# Altium project UWRT_Project_Template.PrjPcb
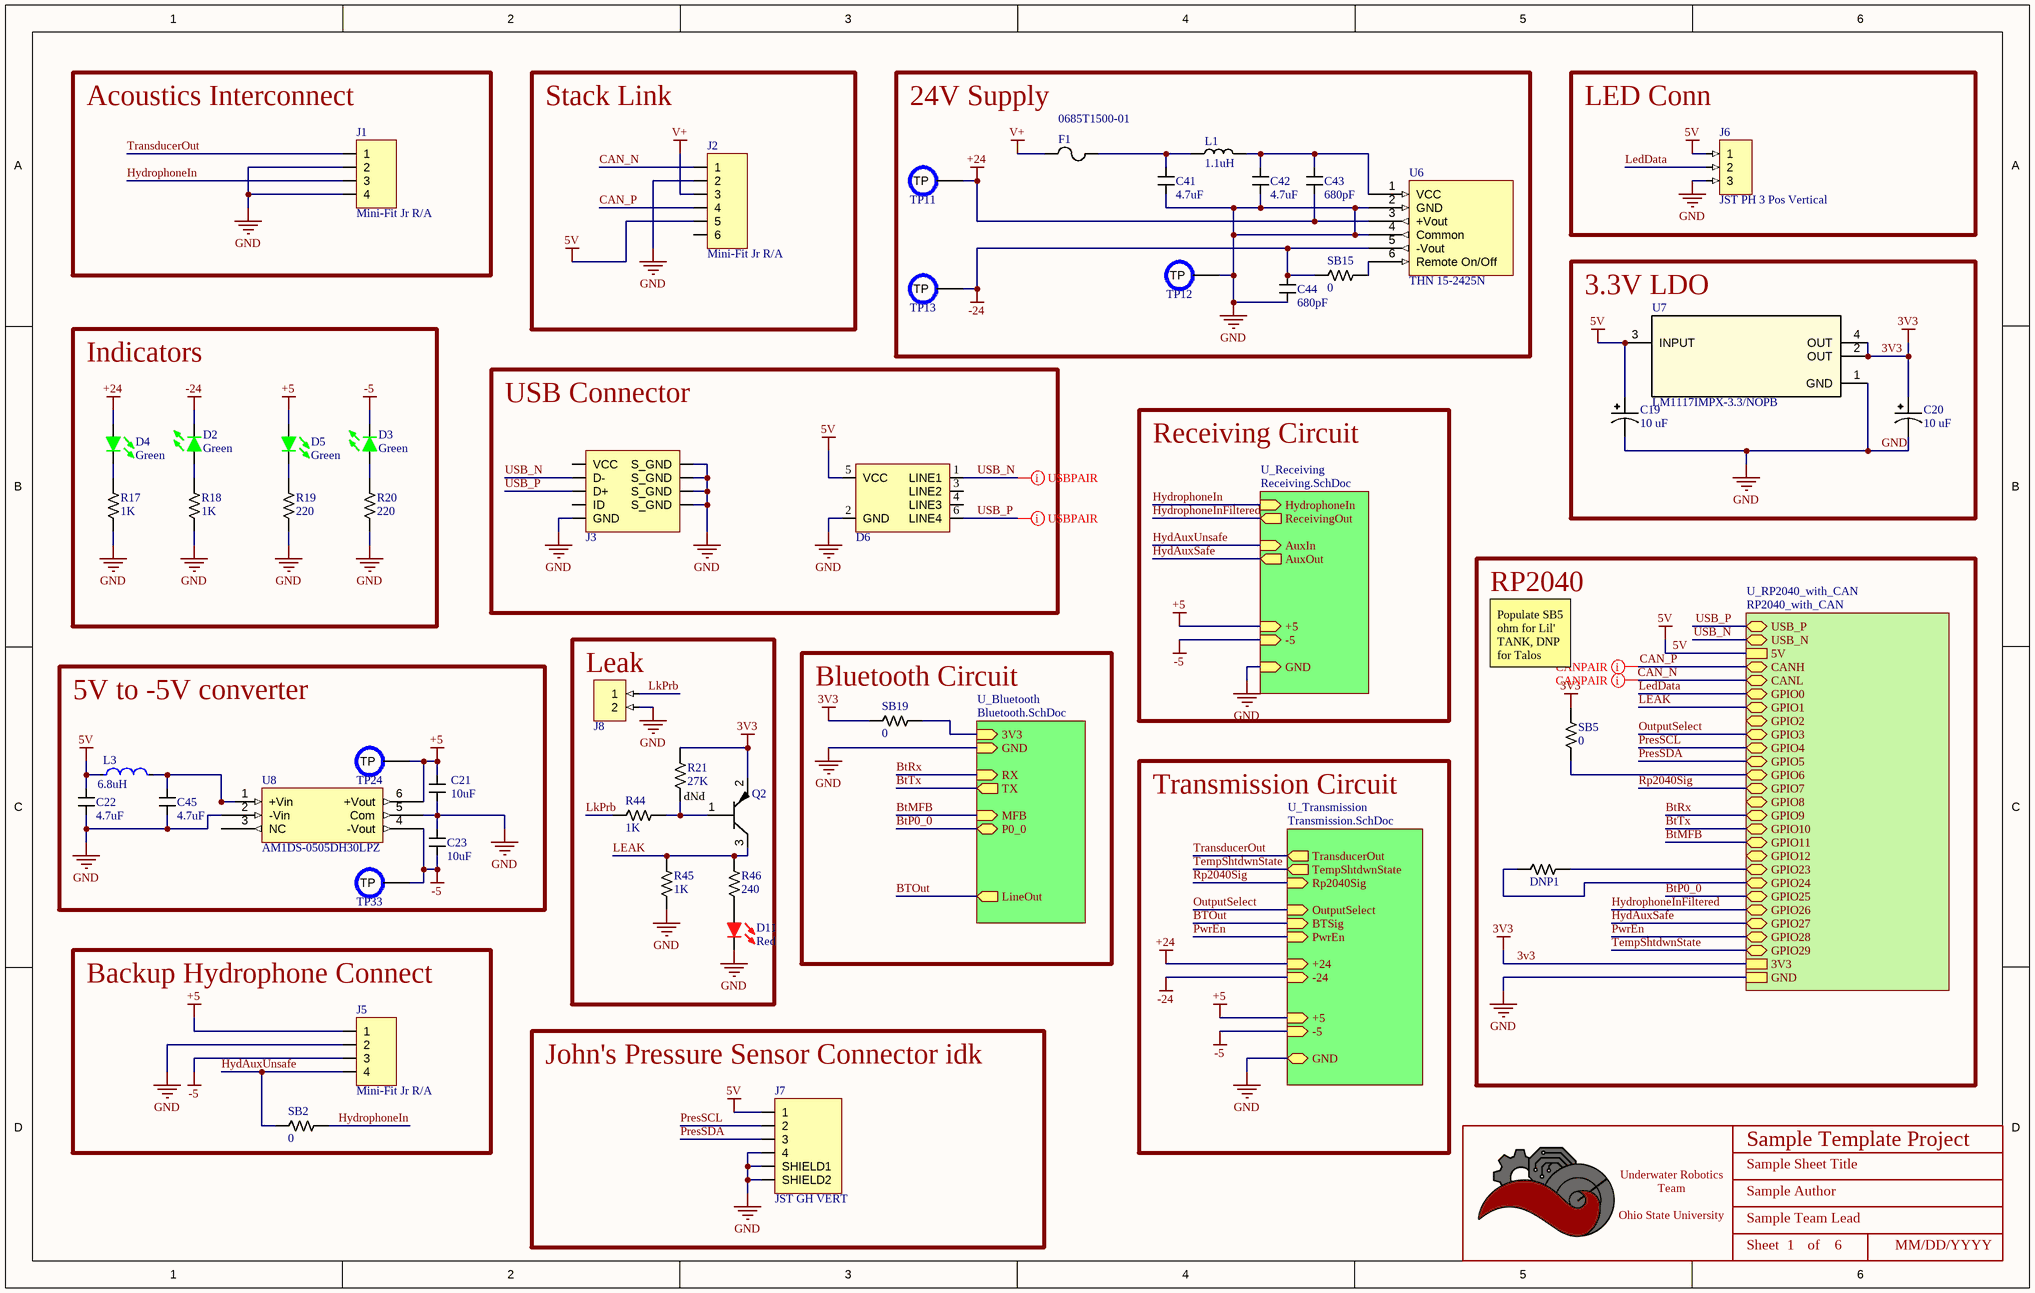
[diagram p0: PowerAndConnections.SchDoc]
BoardRevision: 1.0; DateOfDesignReview: XX/XX/XXXX; ProjectTitle: Sample Template Project; TeamLead: Sample Team Lead
3 sheets, 161 parts. Net scope: hierarchical (ports join the sheet entries above them; power ports are global).
Board files: Pcb_4layer_4x4_Template.PcbDoc, Pcb_2layer_4x4_Template.PcbDoc, Pcb_2layer_8x4_Template_NoCenterHoles.PcbDoc, Pcb_4layer_8x4_Template_NoCenterHoles.PcbDoc, Pcb_2layer_8x4_Template.PcbDoc, Pcb_4layer_8x4_Template.PcbDoc
Sheets:
  PowerAndConnections.SchDoc
    U_Receiving = Receiving.SchDoc
    U_Transmission = Transmission.SchDoc

## Sheet PowerAndConnections.SchDoc: Sample Sheet Title
size B; Date: MM/DD/YYYY; Author: Sample Author; Organization: ORGANIZATION; Address1: ADDRESS 1; Address2: ADDRESS 2; Address3: ADDRESS 3; Address4: ADDRESS 4; Revision: -; SheetNumber: 1; SheetTotal: 6; ENG_APP_DATE: --/--/--; DSN_APP_DATE: --/--/--; CHK_APP_DATE: --/--/--

### Parts
(Parts that share a designator on the sheet are numbered #1, #2 ... from top to bottom, then left to right.)
*#1  Title_Block  [LOGO]  (value not drawn)  (graphical)
C19  Value (uF): 10 uF  [CAPACITOR_1206 - POLAR]  (hidden comment: 10uF Tantalum 16V)
C20  Value (uF): 10 uF  [CAPACITOR_1206 - POLAR]  (hidden comment: 10uF Tantalum 16V)
C21  value 10uF  [CAPACITOR_0603]  (hidden comment: CL10X106MO8NRNC)
C22  value 4.7uF  [CAPACITOR_0603]  (hidden comment: 4.7uF Ceramic 6.3V)
C23  value 10uF  [CAPACITOR_0603]  (hidden comment: CL10X106MO8NRNC)
C41  value 4.7uF  [CAPACITOR_1206]  (hidden comment: AGC1206X7R500-475KXE*)
C42  value 4.7uF  [CAPACITOR_1206]  (hidden comment: AGC1206X7R500-475KXE*)
C43  value 680pF  [CAPACITOR_1808]  (hidden comment: CC1808KKX7REBB681)
C44  value 680pF  [CAPACITOR_1808]  (hidden comment: CC1808KKX7REBB681)
C45  value 4.7uF  [CAPACITOR_0603]  (hidden comment: 4.7uF Ceramic 6.3V)
D2  Color: Green  [LED_0603]  (hidden comment: 150060GS75000)
D3  Color: Green  [LED_0603]  (hidden comment: 150060GS75000)
D4  Color: Green  [LED_0603]  (hidden comment: 150060GS75000)
D5  Color: Green  [LED_0603]  (hidden comment: 150060GS75000)
D6  TVS DIODE 5VWM 25VC SOT23-6  [SOT 23-6L]  (value not drawn)
D11  Color: Red  [LED_0603]  (hidden comment: 150060RS75000)
DNP1  DNP  [RESISTOR_0402]  (value not drawn)
F1  0685T1500-01  [CAPACITOR_1206]
J1  Mini-Fit Jr R/A  [CONN_MOLEX_MINIFIT JR_4 POS_R/A]
J2  Mini-Fit Jr R/A  [CONN_MOLEX_MINIFIT JR_6 POS_R/A]
J3  USB_MICRO R/A  [CONN_MINIUSB]  (value not drawn)
J5  Mini-Fit Jr R/A  [CONN_MOLEX_MINIFIT JR_4 POS_R/A]
J6  JST PH 3 Pos Vertical  [CONN_JST_PH_3POS_VERT]
J7  JST GH VERT  [CONN_JST_BM04B-GHS-TBT(LF)(SN)(N)]
J8  CONN_JST_PH_2POS_VERT  [CONN_JST_PH_2POS_VERT]  (value not drawn)
L1  value 1.1uH  [INDUCTOR_TCK078]  (hidden comment: TCK-078)
L3  value 6.8uH  [INDUCTOR_0805]  (hidden comment: MLZ2012N6R8LT000)
Q2  PNP 60V 600mA SOT23  [SOT-23-3]  (value not drawn)
R17  Value  (Ohms): 1K  [RESISTOR_0603]  (hidden comment: 1k Ohm 5% 1/8W)
R18  Value  (Ohms): 1K  [RESISTOR_0603]  (hidden comment: 1k Ohm 5% 1/8W)
R19  Value  (Ohms): 220  [RESISTOR_0603]  (hidden comment: 220 Ohm 5% 1/8W)
R20  Value  (Ohms): 220  [RESISTOR_0603]  (hidden comment: 220 Ohm 5% 1/8W)
R21  Value  (Ohms): 27K  [RESISTOR_0603]  (hidden comment: 27k Ohm 5% 1/8W)
R44  Value  (Ohms): 1K  [RESISTOR_0603]  (hidden comment: 1k Ohm 5% 1/8W)
R45  Value  (Ohms): 1K  [RESISTOR_0603]  (hidden comment: 1k Ohm 5% 1/8W)
R46  Value  (Ohms): 240  [RESISTOR_0603]  (hidden comment: RES SMD 240 OHM 5% 1/10W 0603)
SB2#1  Value  (Ohms): 0  [RESISTOR_0603]  (hidden comment: 0 Ohm Jumper No Fit)
SB5  Value  (Ohms): 0  [RESISTOR_0603]  (hidden comment: 0 Ohm Jumper No Fit)
SB15  value 0  [RESISTOR_1206]  (hidden comment: JUMPER_0_1206)
SB19  Value  (Ohms): 0  [RESISTOR_0603]  (hidden comment: 0 Ohm Jumper No Fit)
TP11  PCB Test Point  [TESTPOINT_1.2MM]  (value not drawn)  (no BOM)
TP12  PCB Test Point  [TESTPOINT_1.2MM]  (value not drawn)  (no BOM)
TP13  PCB Test Point  [TESTPOINT_1.2MM]  (value not drawn)  (no BOM)
TP24#1  PCB Test Point  [TESTPOINT_1.2MM]  (value not drawn)  (no BOM)
TP33  PCB Test Point  [TESTPOINT_1.2MM]  (value not drawn)  (no BOM)
U6  THN 15-2425N  [THN_15-2425N]
U7  LM1117IMPX-3.3/NOPB  [SOT-223-4]
U8  AM1DS-0505DH30LPZ  [AM1DS-0505DH30LPZ]

### Blocks framed on the sheet
Acoustics Interconnect: J1
Stack Link: J2
24V Supply: C41-C44 F1 L1 SB15 TP11-TP13 U6
LED Conn: J6
3.3V LDO: C19 C20 U7
Indicators: D2-D5 R17-R20
USB Connector: D6 J3
RP2040: DNP1 SB5
5V to -5V converter: C21-C23 C45 L3 TP24#1 TP33 U8
Leak: D11 J8 Q2 R21 R44-R46
Bluetooth Circuit: SB19
Backup Hydrophone Connect: J5 SB2#1
John's Pressure Sensor Connector idk: J7

### Sub-sheets
U_Bluetooth = Bluetooth.SchDoc (file not in this document): 3V3 (in), GND (in), MFB (in), RX (in), TX (out), P0_0 (bidir), LineOut (out)
U_Receiving = Receiving.SchDoc: +5 (in), GND (in), HydrophoneIn (in), ReceivingOut (out), -5 (in), AuxIn (in), AuxOut (out)
U_RP2040_with_CAN = RP2040_with_CAN (file not in this document): USB_P (bidir), USB_N (bidir), 5V, CANH (bidir), CANL (bidir), GPIO0 (bidir), GPIO1 (bidir), GPIO2 (bidir), GPIO3 (bidir), GPIO4 (bidir), GPIO5 (bidir), GPIO6 (bidir), GPIO7 (bidir), GPIO8 (bidir), GPIO9 (bidir), GPIO10 (bidir), GPIO11 (bidir), GPIO12 (bidir), GPIO23 (bidir), GPIO24 (bidir), GPIO25 (bidir), GPIO26 (bidir), GPIO27 (bidir), GPIO28 (bidir), GPIO29 (bidir), 3V3, GND
U_Transmission = Transmission.SchDoc: TransducerOut (out), TempShtdwnState (out), +24 (in), -24 (in), +5 (in), -5 (in), GND (bidir), Rp2040Sig (in), OutputSelect (in), BTSig (in), PwrEn (in)

### Nets
3V3: C20.1 Q2.2 R21.1 SB5.1 SB19.2 U7.2(OUT) U7.4(OUT) ; sheet U_RP2040_with_CAN/3V3
5V: C19.1 C22.1 D6.5(VCC) J2.5 J6.1 J7.1 L3.1 U7.3(INPUT) ; sheet U_RP2040_with_CAN/5V
+5: C21.1 D5.1 J5.1 TP24#1.TP U8.6(+Vout) ; sheet U_Receiving/+5, sheet U_Transmission/+5
+24: C43.2 D4.1 TP11.TP U6.3(+Vout) ; sheet U_Transmission/+24
-5: C23.2 D3.2 J5.3 TP33.TP U8.4(-Vout) ; sheet U_Receiving/-5, sheet U_Transmission/-5
-24: C44.1 D2.2 SB15.2 TP13.TP U6.5(-Vout) ; sheet U_Transmission/-24
GND: C19.2 C20.2 C21.2 C22.2 C23.1 C41.2 C42.2 C44.2 C45.2 D6.2(GND) D11.2 J1.2 J1.4 J2.2 J3.5(GND) J3.6(S_GND) J3.7(S_GND) J3.8(S_GND) J3.9(S_GND) J5.2 J6.3 J7.4 J7.S1(SHIELD1) J7.S2(SHIELD2) J8.2 R17.2 R18.2 R19.2 R20.2 R45.2 TP12.TP U6.2(GND) U6.4(Common) U7.1(GND) U8.2(-Vin) U8.5(Com) ; sheet U_RP2040_with_CAN/GND, sheet U_Receiving/GND, sheet U_Bluetooth/GND, sheet U_Transmission/GND
V+: F1.1 J2.3
BtMFB: sheet U_RP2040_with_CAN/GPIO11, sheet U_Bluetooth/MFB
BTOut: sheet U_Bluetooth/LineOut, sheet U_Transmission/BTSig
BtP0_0: sheet U_RP2040_with_CAN/GPIO25, sheet U_Bluetooth/P0_0
BtRx: sheet U_RP2040_with_CAN/GPIO9, sheet U_Bluetooth/RX
BtTx: sheet U_RP2040_with_CAN/GPIO10, sheet U_Bluetooth/TX
CAN_N: J2.1 ; sheet U_RP2040_with_CAN/CANL
CAN_P: J2.4 ; sheet U_RP2040_with_CAN/CANH
HydAuxSafe: sheet U_RP2040_with_CAN/GPIO27, sheet U_Receiving/AuxOut
HydAuxUnsafe: J5.4 SB2#1.2 ; sheet U_Receiving/AuxIn
HydrophoneIn: J1.3 SB2#1.1 ; sheet U_Receiving/HydrophoneIn
HydrophoneInFiltered: sheet U_RP2040_with_CAN/GPIO26, sheet U_Receiving/ReceivingOut
LEAK: Q2.3 R45.1 R46.1 ; sheet U_RP2040_with_CAN/GPIO1
LedData: J6.2 ; sheet U_RP2040_with_CAN/GPIO0
LkPrb: J8.1 R44.2
OutputSelect: sheet U_RP2040_with_CAN/GPIO3, sheet U_Transmission/OutputSelect
PresSCL: J7.2 ; sheet U_RP2040_with_CAN/GPIO4
PresSDA: J7.3 ; sheet U_RP2040_with_CAN/GPIO5
PwrEn: sheet U_RP2040_with_CAN/GPIO28, sheet U_Transmission/PwrEn
Rp2040Sig: sheet U_RP2040_with_CAN/GPIO7, sheet U_Transmission/Rp2040Sig
TempShtdwnState: sheet U_RP2040_with_CAN/GPIO29, sheet U_Transmission/TempShtdwnState
TransducerOut: J1.1 ; sheet U_Transmission/TransducerOut
USB_N: D6.1(LINE1) J3.2(D-) ; sheet U_RP2040_with_CAN/USB_N
USB_P: D6.6(LINE4) J3.3(D+) ; sheet U_RP2040_with_CAN/USB_P
NetC41_1: C41.1 F1.2 L1.1
NetC42_1: C42.1 C43.1 L1.2 U6.1(VCC)
NetC45_1: C45.1 L3.2 U8.1(+Vin)
NetD2_1: D2.1 R18.1
NetD3_1: D3.1 R20.1
NetD4_2: D4.2 R17.1
NetD5_2: D5.2 R19.1
NetD11_1: D11.1 R46.2
NetDNP1_1: DNP1.1 ; sheet U_RP2040_with_CAN/GPIO23
NetDNP1_2: DNP1.2 ; sheet U_RP2040_with_CAN/GPIO24
NetQ2_1: Q2.1 R21.2 R44.1
NetSB5_2: SB5.2 ; sheet U_RP2040_with_CAN/GPIO6
NetSB15_1: SB15.1 U6.6(Remote_On/Off)
NetSB19_1: SB19.1 ; sheet U_Bluetooth/3V3

Not connected (* = marked no-connect by the designer): D6 3(LINE2) 4(LINE3); J2 6; J3 1(VCC) 4(ID); U8 3(NC)

### Layout directives
differential pair: CAN_N, CAN_P, USB_N, USB_P

### Notes on the sheet
- Receiving Circuit
- Populate SB5 ohm for Lil' TANK, DNP for Talos
- Transmission Circuit
- DWG. NO.
- REV.
- SHT.
- THIS DOCUMENT AND THE DATA DISCLOSED HEREIN OR HEREWITH IS THE PROPERTY OF ALTIUM LIMITED AND MAY BE FREELY DISTRIBUTED IN WHOLE. NO RIGHTS ARE RESERVED OR EXPRESS OR IMPLIED WARANTEE GIVEN.
- REVISION
- DESCRIPTION
- DATE
- APPROVED
- ENG:
- APPROVALS
- PROJECT
- DSN:
- CHK:
- REFERENCE DOCUMENTS
- PROJECT REVISION:
- TITLE
- DOCUMENT REVISION:
- DESIGN ITEM:
- BOM:
- FAB DWG:
- PCB DWG:
- ASSY DWG:
- SCALE:
- SIZE
- B
- CAGE CODE
- FILE NAME
- DWG NO.
- SHEET
- OF
- REV
- (in symbol Title_Block) Underwater Robotics Team / Ohio State University; Sheet; of

### Library data of the parts
*#1 = Title_Block: UWRT Schematic Title Block Template / Created June 2021, Dylan Trainor
C19 C20 = CAPACITOR_10uF_1206_Tantalum_1: Cap 10uF 16V +/-20% / Tantalum 1206; Tolerance: +/- 10%; Made By: Dylan T; ComponentLink1Description: Digikey; ComponentLink1URL: https://www.digikey.com/en/products/detail/kyocera-avx/F981A106MMA/4004990; Voltage: 16V; Supplier 1: Newark; Supplier Part Number 1: 26AC4143
C21 C23 = CAP CER 10UF 16V X6S 0603: 10 µF ±20% 16V Ceramic Capacitor X6S 0603 (1608 Metric)
C22 C45 = CAPACITOR_4.7uF_0603: Cap 4.7uF 6.3V +/-10% / Ceramic 0603; Made By: Robert Pafford; Tolerance: +/- 10%; Voltage: 6.3V; Supplier 1: Digi-Key; Supplier Part Number 1: 1276-2087-1-ND
C41 C42 = 4.7u Auto Grade Capacitor,1206,X7R,50: 4.7 µF ±10% 50V Ceramic Capacitor X7R 1206 (3216 Metric)
C43 C44 = CAP CER 680PF 3KV X7R 1808
D2-D5 = LED_Green_0603_3.2V: LED Green Vf= 3.2V If = 0.025A / 150060GS75000; Made By: Flip B; Forward Current: 25mA; Supplier 1: Digi-Key; ComponentLink1Description: Datasheet; ComponentLink1URL: https://www.we-online.de/katalog/datasheet/150060GS75000.pdf; Supplier Part Number 1: 732-4971-1-ND; Forward Voltage: 3.2V; Package: 0603
D6 = RCLAMP0504S.TCT: 25V Clamp 6A (8/20µs) Ipp Tvs Diode Surface Mount SOT-23-6; Made By: Robert Pafford; Reverse Standoff Voltage (Typ): 5V; Breakdown Voltage (Min): 6V; Supplier 1: Digi-Key; Supplier Part Number 1: RCLAMP0504SCT-ND; Clamping Voltage (Max): 25V
D11 = LED_Red_0603: LED Red Vf= 2V If = 0.020A / 150060RS75000; Made By: Robert Pafford; Forward Current: 20mA; Forward Voltage: 2V; Package: 0603; Supplier 1: Digi-Key; Supplier Part Number 1: 732-4978-1-ND
DNP1 = DNP_0402: Do Not Populate 0402
F1 = 0685T1500-01: FUSE BRD MNT 1.5A 63VAC/VDC 1206
J1 J5 = CONN_MOLEX_MINIFIT JR_4POS_R/A: Molex Minifit Jr. 5569 / 4 Pos R/A Natural; Pitch: 4.2mm; Configuration: Right Angle; Current Per Pin: 13A; Number of Positions: 4; Supplier Part Number 1: WM13112-ND; Supplier 1: Digi-Key; Manufacturer: Molex; Color: Natural; Created By: Flip B; ComponentLink1Description: Datasheet; ComponentLink1URL: https://www.molex.com/pdm_docs/sd/026013115_sd.pdf; Series: Minifit Jr 5569
J2 = CONN_MOLEX_MINIFIT JR_6POS_R/A: Molex Minifit Jr. 5569 / 6 Pos R/A Natural; Pitch: 4.2mm; Configuration: Right Angle; Current Per Pin: 13A; Number of Positions: 8; Manufacturer: Molex; Color: Natural; Created By: Flip B; ComponentLink1Description: Datasheet; ComponentLink1URL: https://www.molex.com/pdm_docs/ps/PS-5556-001.pdf; Series: Minifit Jr 5569; Supplier 1: Digi-Key; Supplier Part Number 1: WM1353-ND
J3 = CONN_MICROUSB: Amphenol Micro USB-B / USB2.0 5 Pin Right Angle SMD; Pitch: 0.65mm; Current Per Pin: 1.8A; Number of Positions: 5; Manufacturer: Amphenol; Configuration: Right Angle; Color: Silver; Created By: Flip B; ComponentLink1Description: Datasheet; ComponentLink1URL: https://cdn.amphenol-icc.com/media/wysiwyg/files/documentation/datasheet/inputoutput/io_usb_micro.pdf?__cf_chl_jschl_tk__=05693735e19256298f6ef6ca2bb2e65c376a4f56-1625503833-0-Abitsb0-ufjOXJYs_S3J3r2iTn-nObalbmXUksF1VvO_h_WEmRdMlUD1I8-hmWSEVWzY1pirKnrPZWfgY3851qyBZe5ZvnNQePLGIzUgdEIQBVUyW36RsbYpDLEWxJ4horD-5gChFgobLYqwmG5aHl0E8lIn_twwPPrOxilK2gP0q9t_CNOs_u5fMqXvXUrlsOv8tIE2NRlu6NVP8qtkL2GjhlkeTUbDMF8WvvpPDTFOgvZ4Y16Ej8F8AhWos88mo5B1HssXozw0XrkJQIqERITUu6rqloz9kf4ZzhBHtDAt-IkiAFY_Ds9SW8FYKKTtINJVpHZQ6Gyu1FFM4Dc9MO0maE8_mmNcwlxqyRoRk_MPWW8VyByXWM5RSp52jteRKw7FeI9WIYvCbPAOy0Eyib-aseIQsnGbglBcUY6_2xp8GYaJM38H3dNvBPsSOfJBPndKedwKHllxjkucXn6xsN0sDXkpGN-cu8_2bDTJ0g-uUucKSCooYX-ApSDNGpkA_p9zv1SOAD8c0zaZVmtiBsN75QpVz2rzq9_BFxOywPvR; Series: 10118192; Supplier 1: Digi-Key; Supplier Part Number 1: 609-4613-1-ND
J6 = CONN_JST_PH_3POS_VERT
J7 = CONN_JST_GH_4POS_VERT: JST GH Pitch 4 Pos Vertical; Pitch: 1.25mm; Current Per Pin: 1A; Number of Positions: 4; Manufacturer: JST; Configuration: Vertical; Color: Natural; Created By: Robert P; Series: GH; Supplier 1: Digi-Key; Supplier Part Number 1: 455-1580-1-ND
J8 = CONN_JST_PH_2POS_VERT: JST PH 2 Pos Vert
L1 = FIXED IND 1.1UH 3.24A 15 MOHM: 1.1 µH Unshielded Inductor 3.24 A 15mOhm Max Nonstandard
L3 = INDUCTOR_6.8uH_Shielded Multilayer ±20% 550mA 325mΩ SMD 0805: Shielded Multilayer Inductor 6.8uH ±20% 550mA 325mΩ SMD 0805; Test Frequency: 2MHz; Self Resonant Frequency: 60MHz; Saturation Current: 110mA; Core Material: Ferrite; DC Resistance (DCR): 250mR; Current Rating: 550mA; Case/Package: 0805; Height - Seated (Max): 0.057inch; Lead Free: Lead Free; Mount: Surface Mount; Max Operating Temperature: 125°C; Length: 0.079inch; Min Operating Temperature: -55°C; RoHS Compliant: Yes; Case Code (Imperial): 0805; Shielding: Shielded; Tolerance: 20%; Width: 0.049inch; Inductance: 6.8uH; Packaging: Tape and Reel; Package Quantity: 1; Case Code (Metric): 2012
Q2 = MMBT2907A-7-F: PNP 60 V 600mA Surface Mount SOT-23; Vendor: Digikey; Vgs (Max): ±10V; Vgs (th): 800mV @ 250µA; Vdss: 20 V; Power Dissipation: 1.56W (Tc); Rds (on): 50mOhm @ 3A, 4.5V; Amp Rating: 600mA; BJT Type: PNP; Package: TO-236-3, SC-59, SOT-23-3; Manufacturer_Part_Number: MMBT2907A-7-F; Created By: Robert Pafford; ComponentLink1Description: Datasheet; ComponentLink1URL: https://media.digikey.com/pdf/Data%20Sheets/Diodes%20PDFs/MMBT2907A_Rev2016.pdf; Supplier 1: Digi-Key; Supplier Part Number 1: MMBT2907A-FDICT-ND
R17 R18 R44 R45 = RESISTOR_1K_0603: RES 1k OHM 5% 1/8W 0603; Tolerance: +/- 5%; Made By: Robert Pafford; ComponentLink1Description: Datasheet; ComponentLink1URL: https://www.bourns.com/docs/product-datasheets/CRxxxxx.pdf; Wattage: 1/8W; Supplier: Digikey; Digikey Part Numer: CR0603-JW-104ELFTR-ND; Supplier 1: Digi-Key; Supplier Part Number 1: 2019-RK73B1JTTD102JCT-ND
R19 R20 = RESISTOR_200_0603: RES 220 OHM 5% 1/8W 0603; Tolerance: +/- 5%; Made By: John S; ComponentLink1Description: Digikey; ComponentLink1URL: https://www.digikey.com/en/products/detail/koa-speer-electronics-inc/RK73B1JTTD101J/9844701; Wattage: 1/8W; Supplier 1: Digi-Key; Supplier Part Number 1: 2019-RK73B1JTTD221JCT-ND
R21 = RESISTOR_27K_0603_1: RES SMD 27K OHM 5% 1/10W 0603; Tolerance: +/- 5%; Made By: John Ulm; ComponentLink1Description: Datasheet; ComponentLink1URL: https://www.bourns.com/docs/product-datasheets/CRxxxxx.pdf; Wattage: 1/10W; Supplier: Digikey; Digikey Part Numer: ERJ-3GEYJ273V; Supplier 1: Digikey; Supplier Part Number 1: P27KGCT-ND
R46 = RESISTOR_240_0603: Tolerance: +/- 5%; Made By: John Ulm; ComponentLink1Description: Datasheet; ComponentLink1URL: https://www.bourns.com/docs/product-datasheets/CRxxxxx.pdf; Wattage: 1/10W; Supplier: Digikey; Digikey Part Numer: ERJ-3GEYJ241V; Supplier 1: Digikey; Supplier Part Number 1: P240GCT-ND
SB2#1 SB5 SB19 = JUMPER_0_0603: 0 Ohm Jumper No Fit for Solder Bridge; Made By: Robert Pafford; ComponentLink1Description: Digikey; ComponentLink1URL: https://www.digikey.com/en/products/detail/koa-speer-electronics-inc/RK73B1JTTD101J/9844701
SB15 = JUMPER_0_1206: JUMPER 0OHM
TP11-TP13 TP24#1 TP33 = TESTPOINT: Made By: Robert Pafford
U6 = THN 15-2425N: DC DC CONVERTER +/-24V 15W
U7 = LM1117IMPX-3.3/NOPB: IC REG LIN 3.3V 800MA SOT223-4; PartNumber: LM1117IMP-3.3/NOPB; Manufacturer: Texas Instruments; Vin (Max): 15V; Supplier 1: Digi-Key; Supplier Part Number 1: LM1117IMPX-3.3/NOPBCT-ND; Vout (Min/Fixed): 3.3V; Amp Out: 800mA; Package: SOT-223-4; Created By: Dylan T
U8 = AM1DS-0505DH30LPZ: Isolated Module DC DC Converter 2 Output -5V 5V 100mA, 100mA 4.5V - 5.5V Input

## Sheet Receiving.SchDoc: Sample Sheet Title
size B; Date: MM/DD/YYYY; Author: Sample Author; Organization: ORGANIZATION; Address1: ADDRESS 1; Address2: ADDRESS 2; Address3: ADDRESS 3; Address4: ADDRESS 4; Revision: -; SheetNumber: 3; SheetTotal: 6; ENG_APP_DATE: --/--/--; DSN_APP_DATE: --/--/--; CHK_APP_DATE: --/--/--
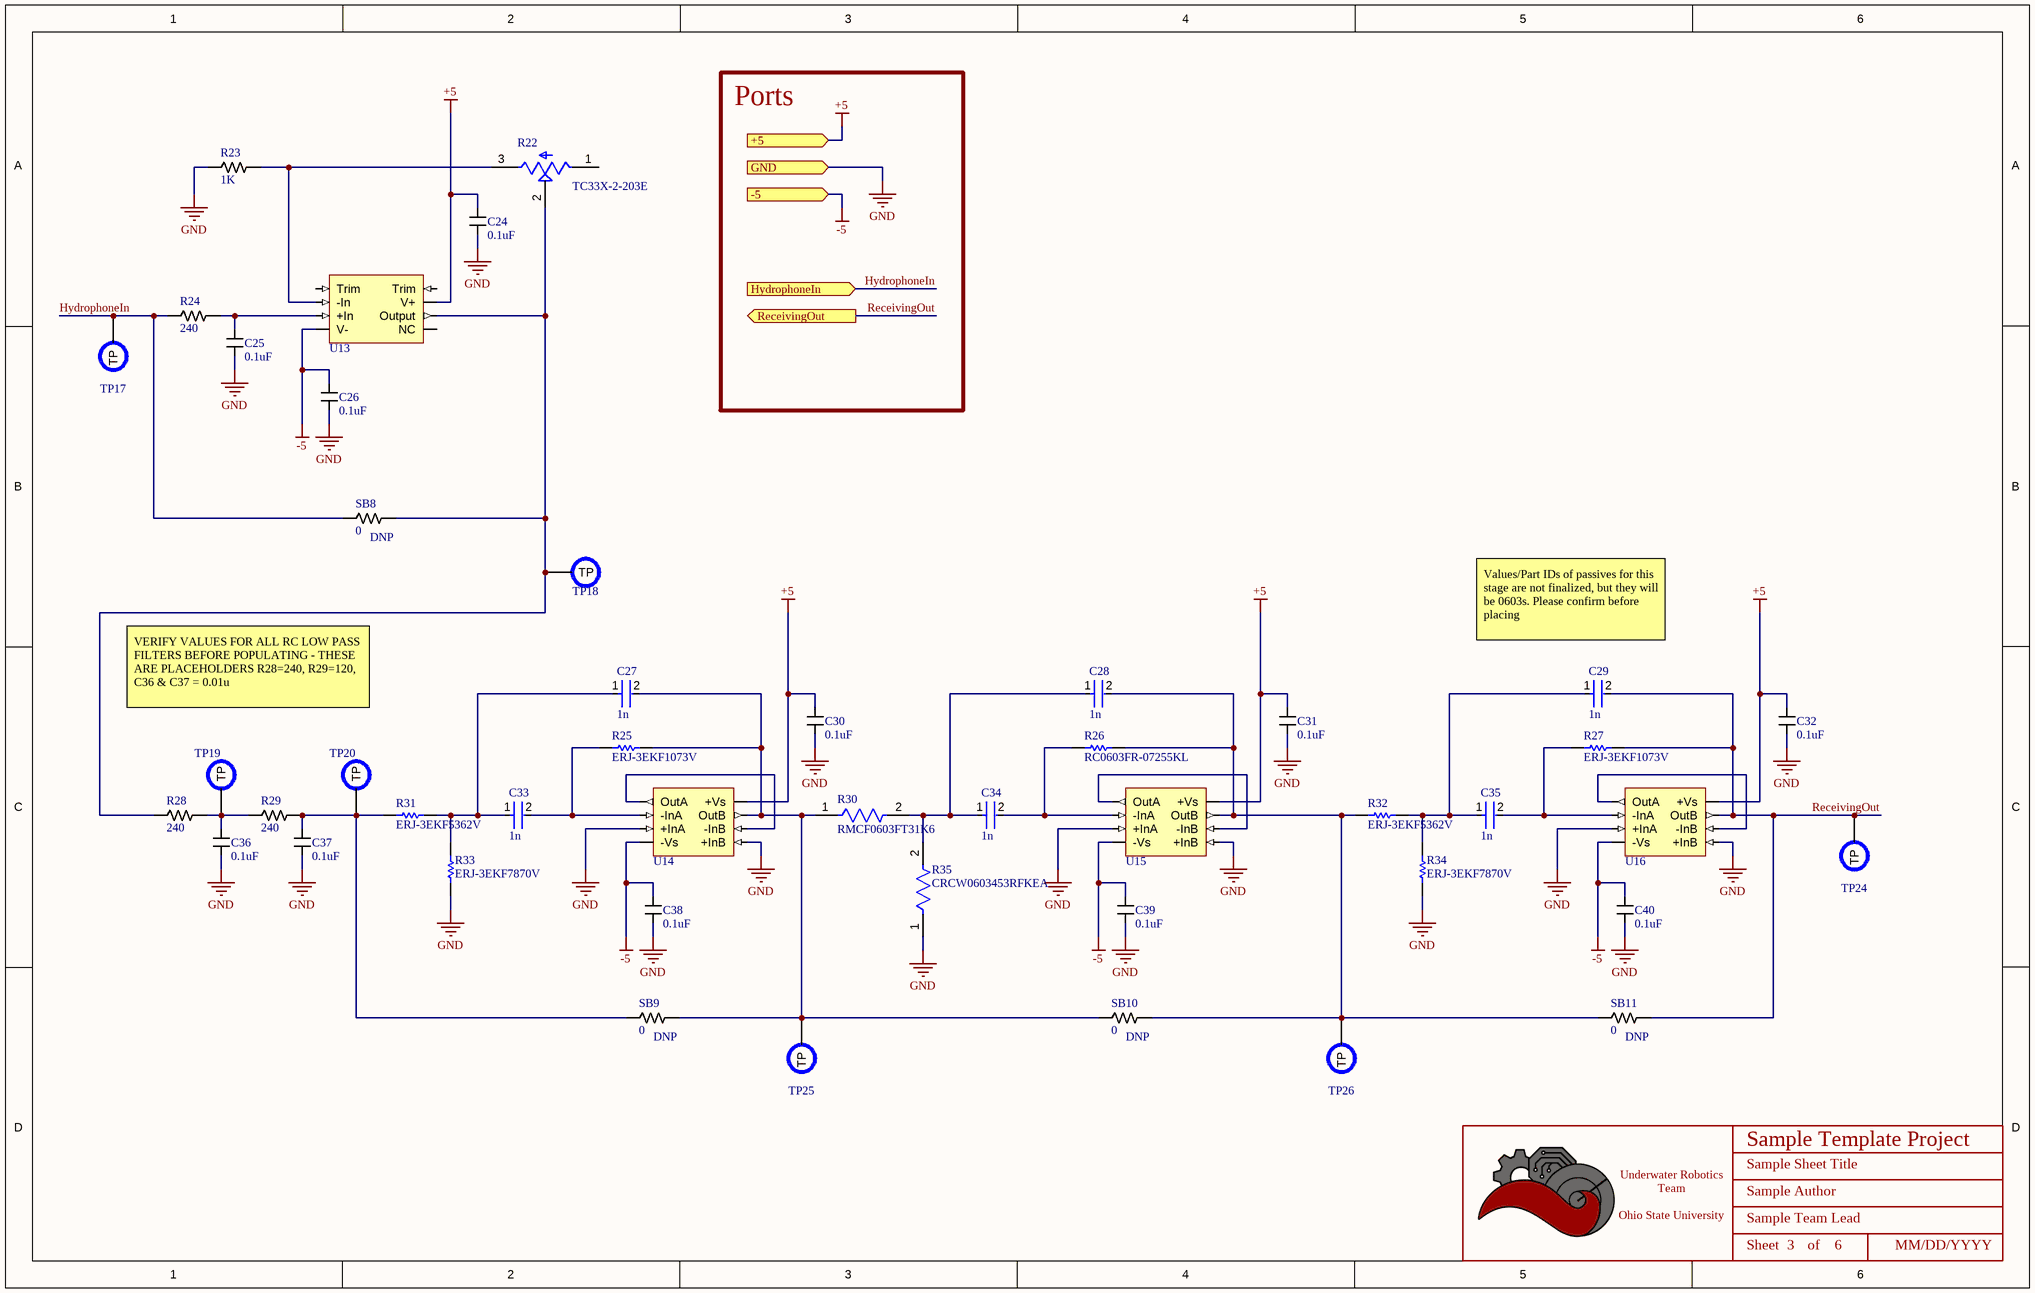
[diagram p1: Receiving.SchDoc]

### Parts
(Parts that share a designator on the sheet are numbered #1, #2 ... from top to bottom, then left to right.)
*#2  Title_Block  [LOGO]  (value not drawn)  (graphical)
C24  value 0.1uF  [CAPACITOR_0603]  (hidden comment: 100nF Ceramic 6.3V)
C25  value 0.1uF  [CAPACITOR_0603]  (hidden comment: 100nF Ceramic 6.3V)
C26  value 0.1uF  [CAPACITOR_0603]  (hidden comment: 100nF Ceramic 6.3V)
C27  1n  [FP-0603-L_1_6_0_15-W_0_81-IPC_A]
C28  1n  [FP-0603-L_1_6_0_15-W_0_81-IPC_A]
C29  1n  [FP-0603-L_1_6_0_15-W_0_81-IPC_A]
C30  value 0.1uF  [CAPACITOR_0603]  (hidden comment: 100nF Ceramic 6.3V)
C31  value 0.1uF  [CAPACITOR_0603]  (hidden comment: 100nF Ceramic 6.3V)
C32  value 0.1uF  [CAPACITOR_0603]  (hidden comment: 100nF Ceramic 6.3V)
C33  1n  [FP-0603-L_1_6_0_15-W_0_81-IPC_A]
C34  1n  [FP-0603-L_1_6_0_15-W_0_81-IPC_A]
C35  1n  [FP-0603-L_1_6_0_15-W_0_81-IPC_A]
C36  value 0.1uF  [CAPACITOR_0603]  (hidden comment: 100nF Ceramic 6.3V)
C37  value 0.1uF  [CAPACITOR_0603]  (hidden comment: 100nF Ceramic 6.3V)
C38  value 0.1uF  [CAPACITOR_0603]  (hidden comment: 100nF Ceramic 6.3V)
C39  value 0.1uF  [CAPACITOR_0603]  (hidden comment: 100nF Ceramic 6.3V)
C40  value 0.1uF  [CAPACITOR_0603]  (hidden comment: 100nF Ceramic 6.3V)
R22  TC33X-2-203E  [TRIM_TC33X-2-203E]
R23  Value  (Ohms): 1K  [RESISTOR_0603]  (hidden comment: 1k Ohm 5% 1/8W)
R24  Value  (Ohms): 240  [RESISTOR_0603]  (hidden comment: RES SMD 240 OHM 5% 1/10W 0603)
R25  ERJ-3EKF1073V  [RESC1608X55X30ML15T15]
R26  RC0603FR-07255KL  [RESC1608X55X25LL10T15]
R27  ERJ-3EKF1073V  [RESC1608X55X30ML15T15]
R28  Value  (Ohms): 240  [RESISTOR_0603]  (hidden comment: RES SMD 240 OHM 5% 1/10W 0603)
R29  Value  (Ohms): 240  [RESISTOR_0603]  (hidden comment: RES SMD 240 OHM 5% 1/10W 0603)
R30  RMCF0603FT31K6  [FP-RMCF0603-IPC_A]
R31  ERJ-3EKF5362V  [RESC1608X55X30NL15T15]
R32  ERJ-3EKF5362V  [RESC1608X55X30NL15T15]
R33  ERJ-3EKF7870V  [RESC1608X55X30ML15T15]
R34  ERJ-3EKF7870V  [RESC1608X55X30ML15T15]
R35  CRCW0603453RFKEA  [FP-CRCW0603-e3-IPC_C]
SB8  Value  (Ohms): 0  [RESISTOR_0603]  (hidden comment: 0 Ohm Jumper No Fit)
SB9  Value  (Ohms): 0  [RESISTOR_0603]  (hidden comment: 0 Ohm Jumper No Fit)
SB10  Value  (Ohms): 0  [RESISTOR_0603]  (hidden comment: 0 Ohm Jumper No Fit)
SB11  Value  (Ohms): 0  [RESISTOR_0603]  (hidden comment: 0 Ohm Jumper No Fit)
TP17  PCB Test Point  [TESTPOINT_1.2MM]  (value not drawn)  (no BOM)
TP18  PCB Test Point  [TESTPOINT_1.2MM]  (value not drawn)  (no BOM)
TP19  PCB Test Point  [TESTPOINT_1.2MM]  (value not drawn)  (no BOM)
TP20  PCB Test Point  [TESTPOINT_1.2MM]  (value not drawn)  (no BOM)
TP24#2  PCB Test Point  [TESTPOINT_1.2MM]  (value not drawn)  (no BOM)
TP25  PCB Test Point  [TESTPOINT_1.2MM]  (value not drawn)  (no BOM)
TP26  PCB Test Point  [TESTPOINT_1.2MM]  (value not drawn)  (no BOM)
U13  IC OPAMP GP 1 CIRCUIT 8SOIC  [SOIC-8]  (value not drawn)
U14  IC VOLTAGE FEEDBACK 2 CIRC 8SOIC  [SOIC-8]  (value not drawn)
U15  IC VOLTAGE FEEDBACK 2 CIRC 8SOIC  [SOIC-8]  (value not drawn)
U16  IC VOLTAGE FEEDBACK 2 CIRC 8SOIC  [SOIC-8]  (value not drawn)

### Ports
+5 (in), -5 (in), GND (in), HydrophoneIn (in), ReceivingOut (out)

### Nets
+5: C24.1 C30.1 C31.1 C32.1 U13.7(V+) U14.8(+Vs) U15.8(+Vs) U16.8(+Vs) ; port +5
-5: C26.1 C38.1 C39.1 C40.1 U13.4(V-) U14.4(-Vs) U15.4(-Vs) U16.4(-Vs) ; port -5
GND: C24.2 C25.2 C26.2 C30.2 C31.2 C32.2 C36.2 C37.2 C38.2 C39.2 C40.2 R23.2 R33.1 R34.1 R35.1 U14.3(+InA) U14.5(+InB) U15.3(+InA) U15.5(+InB) U16.3(+InA) U16.5(+InB) ; port GND
HydrophoneIn: R24.2 SB8.2 TP17.TP ; port HydrophoneIn
ReceivingOut: C29.2 R27.2 SB11.1 TP24#2.TP U16.7(OutB) ; port ReceivingOut  [project net HydrophoneInFiltered]
NetC25_1: C25.1 R24.1 U13.3(+In)
NetC27_1: C27.1 C33.1 R31.2 R33.2
NetC27_2: C27.2 R25.2 R30.1 SB9.1 SB10.2 TP25.TP U14.7(OutB)
NetC28_1: C28.1 C34.1 R30.2 R35.2
NetC28_2: C28.2 R26.2 R32.1 SB10.1 SB11.2 TP26.TP U15.7(OutB)
NetC29_1: C29.1 C35.1 R32.2 R34.2
NetC33_2: C33.2 R25.1 U14.2(-InA)
NetC34_2: C34.2 R26.1 U15.2(-InA)
NetC35_2: C35.2 R27.1 U16.2(-InA)
NetC36_1: C36.1 R28.1 R29.2 TP19.TP
NetC37_1: C37.1 R29.1 R31.1 SB9.2 TP20.TP
NetR22_2: R22.2(W) R28.2 SB8.1 TP18.TP U13.6(Output)
NetR22_3: R22.3(CW) R23.1 U13.2(-In)
NetU14_1: U14.1(OutA) U14.6(-InB)
NetU15_1: U15.1(OutA) U15.6(-InB)
NetU16_1: U16.1(OutA) U16.6(-InB)

Not connected (* = marked no-connect by the designer): R22 1(CCW); U13 1(Trim) 5(NC) 8(Trim)

### Notes on the sheet
- Ports
- (near SB8) DNP
- Values/Part IDs of passives for this stage are not finalized, but they will be 0603s. Please confirm before placing
- VERIFY VALUES FOR ALL RC LOW PASS FILTERS BEFORE POPULATING - THESE ARE PLACEHOLDERS R28=240, R29=120, C36 & C37 = 0.01u
- (near SB9) DNP
- (near SB10) DNP
- (near SB11) DNP
- DWG. NO.
- REV.
- SHT.
- THIS DOCUMENT AND THE DATA DISCLOSED HEREIN OR HEREWITH IS THE PROPERTY OF ALTIUM LIMITED AND MAY BE FREELY DISTRIBUTED IN WHOLE. NO RIGHTS ARE RESERVED OR EXPRESS OR IMPLIED WARANTEE GIVEN.
- REVISION
- DESCRIPTION
- DATE
- APPROVED
- ENG:
- APPROVALS
- PROJECT
- DSN:
- CHK:
- REFERENCE DOCUMENTS
- PROJECT REVISION:
- TITLE
- DOCUMENT REVISION:
- DESIGN ITEM:
- BOM:
- FAB DWG:
- PCB DWG:
- ASSY DWG:
- SCALE:
- SIZE
- B
- CAGE CODE
- FILE NAME
- DWG NO.
- SHEET
- OF
- REV
- (in symbol Title_Block) Underwater Robotics Team / Ohio State University; Sheet; of

### Library data of the parts
*#2 = Title_Block: as *#1 on sheet PowerAndConnections
C24-C26 C30-C32 C36-C40 = CAPACITOR_0.1uF_0603: Cap 100nF 6.3V +/-10% / Ceramic 0603; Made By: Flip B; ComponentLink1Description: Datsheet; ComponentLink1URL: https://www.mouser.com/datasheet/2/212/KEM_C1002_X7R_SMD-1102033.pdf; Tolerance: +/- 10%; Voltage: 6.3V; Supplier 1: Digi-Key; Supplier Part Number 1: 399-15351-1-ND
C27-C29 C33-C35 = CMP-2006-04378-2: General Purpose Ceramic Capacitor, 0603, 1nF, 10%, X7R, 15%, 50V; Case Code (Metric): 1608; Min Operating Temperature: -55°C; Weight: 7.1E-05oz; Series: -; Capacitance: 1nF; RoHS Compliant: Yes; Radiation Hardening: No; Height: 0.9mm; Mount: Surface Mount; REACH SVHC: No SVHC; Lead Free: Lead Free; Depth: 0.81mm; Voltage: 50V; Number of Pins: 2; Voltage Rating: 50V; Max Operating Temperature: 125°C; Termination: SMD/SMT; Construction: Flat; Case Code (Imperial): 0603; Dielectric: X7R; Width: 0.032inch; Tolerance: 10%; Case/Package: 0603; Contact Plating: Tin; Packaging: Tape and Reel; Voltage Rating (DC): 50V; Dielectric Material: Ceramic; Package Quantity: 4000; Thickness: 0.035inch; Length: 1.6mm
R22 = TC33X-2-203E: 20 kOhms 0.1W, 1/10W J Lead Surface Mount Trimmer Potentiometer Cermet 1 Turn Top Adjustment; MF: Bourns; Value: *; SnapEDA_Link: https://www.snapeda.com/parts/TC33X-2-203E/Bourns/view-part/312812/?ref=snap; Check_prices: https://www.snapeda.com/parts/TC33X-2-203E/Bourns/view-part/312812/?ref=eda; Digi-Key_Part_Number: TC33X-2-203ECT-ND; Purchase-URL: https://pricing.snapeda.com/search/part/TC33X-2-203E/?ref=eda; Package: 1608 Bourns; MP: TC33X-2-203E; Supplier 1: Mouser; Supplier Part Number 1: 652-TC33X-2-203E
R23 = RESISTOR_1K_0603: as R17 on sheet PowerAndConnections; ComponentLink1Description: Datasheet; ComponentLink1URL: https://www.bourns.com/docs/product-datasheets/CRxxxxx.pdf; Wattage: 1/8W; Supplier: Digikey; Digikey Part Numer: CR0603-JW-104ELFTR-ND; Supplier 1: Digi-Key; Supplier Part Number 1: 2019-RK73B1JTTD102JCT-ND
R24 R28 R29 = RESISTOR_240_0603: Tolerance: +/- 5%; Made By: John Ulm; ComponentLink1Description: Datasheet; ComponentLink1URL: https://www.bourns.com/docs/product-datasheets/CRxxxxx.pdf; Wattage: 1/10W; Supplier: Digikey; Digikey Part Numer: ERJ-3GEYJ241V; Supplier 1: Digikey; Supplier Part Number 1: P240GCT-ND
R25 R27 = CMP-2000-00194-1: Manufacturer: Panasonic; Part Number: ERJ-3EKF1073V
R26 = CMP-2000-03969-1: Manufacturer: Yageo; Part Number: RC0603FR-07255KL
R30 = CMP-26527-003233-1: 31.6kΩ ±1% 0.1W 0603 Thick Film Chip Resistor AEC-Q200 compliant; Max Power Dissipation: 100mW; Resistance: 31.6kR; Temperature Coefficient: 100ppm/°C; Tolerance: 1%; Features: Automotive AEC-Q200; Packaging: Tape and Reel; Construction: Rectangular; Number of Terminations: 2; Width: 0.031inch; Case Code (Imperial): 0603; Max Operating Temperature: 155°C; Height: 0.022inch; Mount: Surface Mount; Size Code: 0603; Radiation Hardening: No; Contact Plating: Tin; Resistor Type: Thick Film; Case Code (Metric): 1608; Military Standard: Not; Length: 1.55mm; Min Operating Temperature: -55°C; Depth: 0.8mm; Lead Free: Lead Free; RoHS Compliant: Yes; Power Rating: 100mW; Series: RMCF; Case/Package: 0603
R31 R32 = CMP-2000-00556-1: Manufacturer: Panasonic; Part Number: ERJ-3EKF5362V
R33 R34 = CMP-2000-00644-1: Manufacturer: Panasonic; Part Number: ERJ-3EKF7870V
R35 = CMP-2000-03363-2: RES Thick Film, 453Ω, 1%, 0.1W, 100ppm/°C, 0603; Power Rating: 100mW; Working Voltage: 75V; Resistance: 453R; Length: 1.55mm; Min Operating Temperature: -55°C; Case Code (Metric): 1608; Height: 0.02inch; Composition: Thick Film; Max Power Dissipation: 100mW; Termination: SMD/SMT; Number of Terminations: 2; Package Quantity: 5000; Case Code (Imperial): 0603; Temperature Coefficient: 100ppm/°C; Military Standard: Not; Features: Automotive AEC-Q200; Weight: 7.1E-05oz; Depth: 0.85mm; Packaging: Tape and Reel; Number of Pins: 2; Width: 0.033inch; Case/Package: 0603; Tolerance: 1%; Voltage Rating: 75V; Max Operating Temperature: 155°C; Contact Plating: Tin; Radiation Hardening: No
SB8-SB11 = JUMPER_0_0603: as SB2#1 on sheet PowerAndConnections; ComponentLink1Description: Digikey; ComponentLink1URL: https://www.digikey.com/en/products/detail/koa-speer-electronics-inc/RK73B1JTTD101J/9844701
TP17-TP20 TP24#2 TP25 TP26 = TESTPOINT: Made By: Robert Pafford
U13 = OPA228U: General Purpose Amplifier 1 Circuit 8-SOIC
U14-U16 = OPA2889ID: Voltage Feedback Amplifier 2 Circuit 8-SOIC

## Sheet Transmission.SchDoc: Transmission Circuit
size B; Date: 2/27/2025; Author: Brach Knutson; Organization: ORGANIZATION; Address1: ADDRESS 1; Address2: ADDRESS 2; Address3: ADDRESS 3; Address4: ADDRESS 4; Revision: -; SheetNumber: 2; SheetTotal: 6; ENG_APP_DATE: --/--/--; DSN_APP_DATE: --/--/--; CHK_APP_DATE: --/--/--
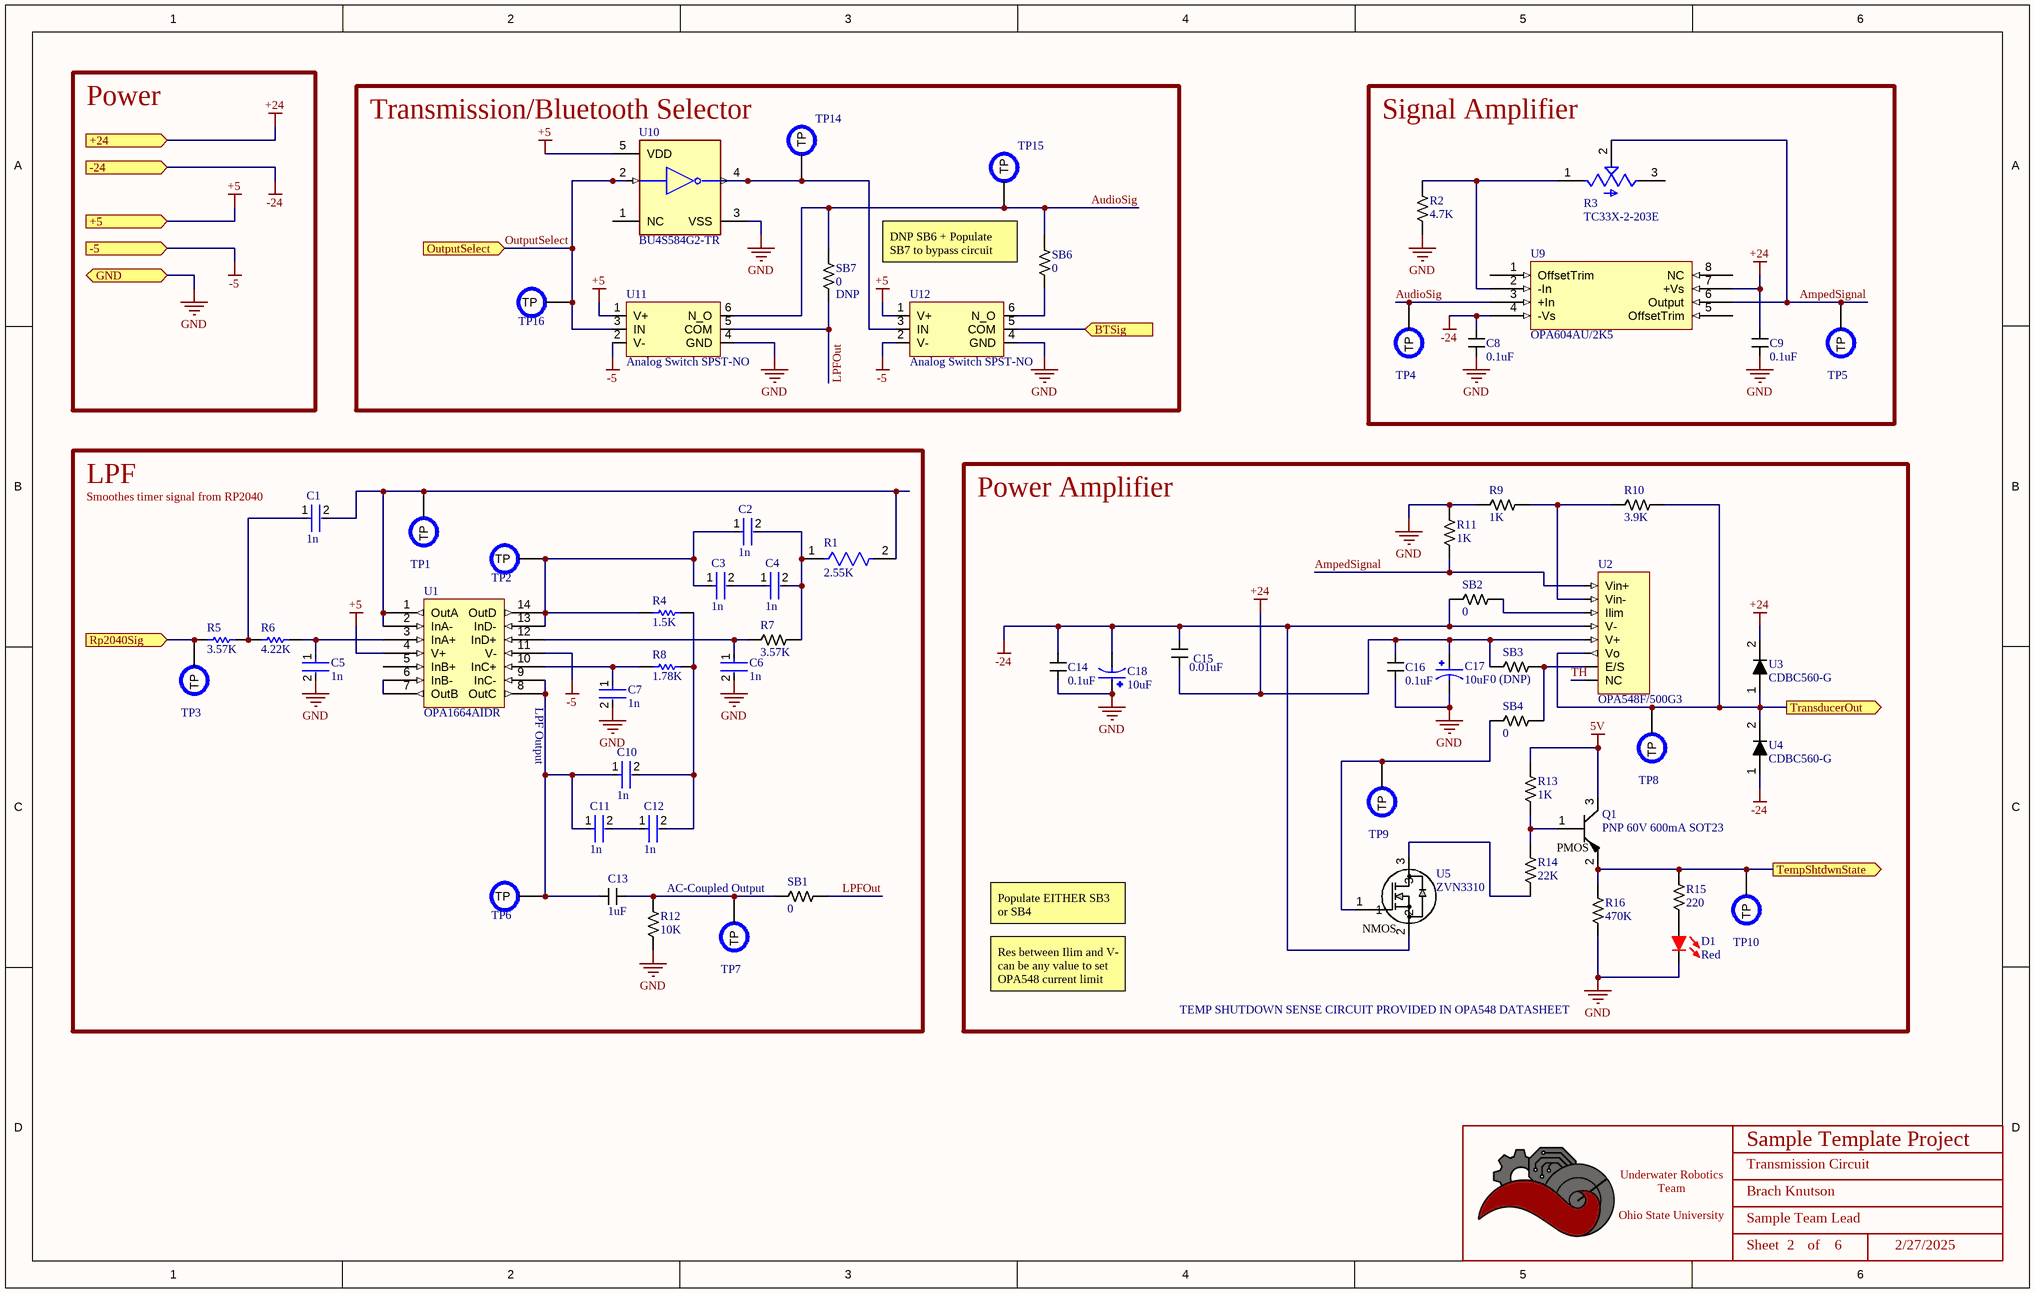
[diagram p2: Transmission.SchDoc]

### Parts
(Parts that share a designator on the sheet are numbered #1, #2 ... from top to bottom, then left to right.)
*#3  Title_Block  [LOGO]  (value not drawn)  (graphical)
C1  1n  [FP-C0603C-CF-MFG]
C2  1n  [FP-C0603C-CF-MFG]
C3  1n  [FP-C0603C-CF-MFG]
C4  1n  [FP-C0603C-CF-MFG]
C5  1n  [FP-C0603C-CF-MFG]
C6  1n  [FP-C0603C-CF-MFG]
C7  1n  [FP-C0603C-CF-MFG]
C8  value 0.1uF  [CAPACITOR_0603]  (hidden comment: 100nF Ceramic 25V)
C9  value 0.1uF  [CAPACITOR_0603]  (hidden comment: 100nF Ceramic 25V)
C10  1n  [FP-C0603C-CF-MFG]
C11  1n  [FP-C0603C-CF-MFG]
C12  1n  [FP-C0603C-CF-MFG]
C13  value 1uF  [CAPACITOR_0603]  (hidden comment: 1uF Ceramic 16V)
C14  value 0.1uF  [CAPACITOR_0603]  (hidden comment: 100nF Ceramic 25V)
C15  value 0.01uF  [CAPACITOR_0603]  (hidden comment: CL10B103KB8NNNC)
C16  value 0.1uF  [CAPACITOR_0603]  (hidden comment: 100nF Ceramic 25V)
C17  value 10uF  [CAP_EEHZC1J100P]  (hidden comment: 10uF electrolytic 63V)
C18  value 10uF  [CAP_EEHZC1J100P]  (hidden comment: 10uF electrolytic 63V)
D1  Color: Red  [LED_0603]  (hidden comment: 150060RS75000)
Q1  PNP 60V 600mA SOT23  [SOT-23-3]
R1  2.55K  [FP-CRCW0603-e3-IPC_B]
R2  Value  (Ohms): 4.7K  [RESISTOR_0603]  (hidden comment: 4.7k Ohm 5% 1/10W)
R3  TC33X-2-203E  [TRIM_TC33X-2-203E]
R4  1.5K  [RESC1608X55X25ML10T15]
R5  3.57K  [RESC1609X50X30NL10T20]
R6  4.22K  [RESC1609X50X30ML10T20]
R7  3.57K  [CAPACITOR_0603]
R8  1.78K  [RESC1608X55X30LL15T15]
R9  Value  (Ohms): 1K  [RESISTOR_0603]  (hidden comment: 1k Ohm 5% 1/8W)
R10  Value  (Ohms): 3.9K  [RESISTOR_0603]  (hidden comment: 3.9k Ohm 5% 1/10W)
R11  Value  (Ohms): 1K  [RESISTOR_0603]  (hidden comment: 1k Ohm 5% 1/8W)
R12  Value  (Ohms): 10K  [RESISTOR_0603]  (hidden comment: 10k Ohm 5% 1/10W)
R13  Value  (Ohms): 1K  [RESISTOR_0603]  (hidden comment: 1k Ohm 5% 1/8W)
R14  Value  (Ohms): 22K  [RESISTOR_0603]  (hidden comment: 3.09k Ohm 1% 1/16W)
R15  Value  (Ohms): 220  [RESISTOR_0603]  (hidden comment: 220 Ohm 5% 1/8W)
R16  Value  (Ohms): 470K  [RESISTOR_0603]  (hidden comment: 470k Ohm 5% 1/10W)
SB1  Value  (Ohms): 0  [RESISTOR_0603]  (hidden comment: 0 Ohm Jumper No Fit)
SB2#2  Value  (Ohms): 0  [RESISTOR_0603]  (hidden comment: 0 Ohm Jumper No Fit)
SB3  Value  (Ohms): 0 (DNP)  [RESISTOR_0603]  (hidden comment: 0 Ohm Jumper No Fit)
SB4  Value  (Ohms): 0  [RESISTOR_0603]  (hidden comment: 0 Ohm Jumper No Fit)
SB6  Value  (Ohms): 0  [RESISTOR_0603]  (hidden comment: 0 Ohm Jumper No Fit)
SB7  Value  (Ohms): 0  [RESISTOR_0603]  (hidden comment: 0 Ohm Jumper No Fit)
TP1  PCB Test Point  [TESTPOINT_1.2MM]  (value not drawn)  (no BOM)
TP2  PCB Test Point  [TESTPOINT_1.2MM]  (value not drawn)  (no BOM)
TP3  PCB Test Point  [TESTPOINT_1.2MM]  (value not drawn)  (no BOM)
TP4  PCB Test Point  [TESTPOINT_1.2MM]  (value not drawn)  (no BOM)
TP5  PCB Test Point  [TESTPOINT_1.2MM]  (value not drawn)  (no BOM)
TP6  PCB Test Point  [TESTPOINT_1.2MM]  (value not drawn)  (no BOM)
TP7  PCB Test Point  [TESTPOINT_1.2MM]  (value not drawn)  (no BOM)
TP8  PCB Test Point  [TESTPOINT_1.2MM]  (value not drawn)  (no BOM)
TP9  PCB Test Point  [TESTPOINT_1.2MM]  (value not drawn)  (no BOM)
TP10  PCB Test Point  [TESTPOINT_1.2MM]  (value not drawn)  (no BOM)
TP14  PCB Test Point  [TESTPOINT_1.2MM]  (value not drawn)  (no BOM)
TP15  PCB Test Point  [TESTPOINT_1.2MM]  (value not drawn)  (no BOM)
TP16  PCB Test Point  [TESTPOINT_1.2MM]  (value not drawn)  (no BOM)
U1  OPA1664AIDR  [SOIC-14]
U2  OPA548F/500G3  [7-PIN TO-263]
U3  CDBC560-G  [DO-214AB]
U4  CDBC560-G  [DO-214AB]
U5  ZVN3310  [SOT-23-3]
U9  OPA604AU/2K5  [SOIC-8]
U10  BU4S584G2-TR  [FP-SSOP5-MFG]
U11  Analog Switch SPST-NO  [TSOT-23_S6]
U12  Analog Switch SPST-NO  [TSOT-23_S6]

### Blocks framed on the sheet
Transmission/Bluetooth Selector: SB6 SB7 TP14-TP16 U10-U12
Signal Amplifier: C8 C9 R2 R3 TP4 TP5 U9
LPF: C1-C7 C10-C13 R1 R4-R8 R12 SB1 TP1-TP3 TP6 TP7 U1
Power Amplifier: C14-C18 D1 Q1 R9-R11 R13-R16 SB2#2 SB3 SB4 TP8-TP10 U2-U5

### Ports
+5 (in), +24 (in), -5 (in), -24 (in), BTSig (in), GND (bidir), OutputSelect (in), Rp2040Sig (in), TempShtdwnState (out), TransducerOut (out)

### Nets
5V: Q1.3 R13.1
+5: U1.4(V+) U10.5(VDD) U11.1(V+) U12.1(V+) ; port +5
+24: C9.1 C15.2 C16.1 C17.1 SB3.2 U2.5(V+) U3.2 U9.7(+Vs) ; port +24
-5: U1.11(V-) U11.2(V-) U12.2(V-) ; port -5
-24: C8.1 C14.1 C15.1 C18.2 SB2#2.2 U2.4(V-) U4.1 U5.2 U9.4(-Vs) ; port -24
GND: C5.2 C6.2 C7.2 C8.2 C9.2 C14.2 C16.2 C17.2 C18.1 D1.2 R2.2 R9.2 R11.1 R12.2 R16.2 U10.3(VSS) U11.4(GND) U12.4(GND) ; port GND
AmpedSignal: R3.2(W) R11.2 TP5.TP U2.1(Vin+) U9.6(Output)
AudioSig: SB6.1 SB7.1 TP4.TP TP15.TP U9.3(+In) U11.6(N_O)
BTOut: U12.5(COM) ; port BTSig
LPFOut: SB1.1 SB7.2 U11.5(COM)
OutputSelect: TP16.TP U10.2(A) U11.3(IN) ; port OutputSelect
Rp2040Sig: R5.1 TP3.TP ; port Rp2040Sig
TempShtdwnState: Q1.2 R15.1 R16.1 TP10.TP ; port TempShtdwnState
TH: U2.8(NC)
TransducerOut: R10.1 TP8.TP U2.6(Vo) U3.1 U4.2 ; port TransducerOut
NetC1_1: C1.1 R5.2 R6.1
NetC1_2: C1.2 R1.2 TP1.TP U1.1(OutA) U1.2(InA-)
NetC2_1: C2.1 C3.1 R4.1 TP2.TP U1.13(InD-) U1.14(OutD)
NetC2_2: C2.2 C4.2 R1.1 R7.1
NetC3_2: C3.2 C4.1
NetC5_1: C5.1 R6.2 U1.3(InA+)
NetC6_1: C6.1 R7.2 U1.12(InD+)
NetC7_1: C7.1 R8.1 U1.10(InC+)
NetC10_1: C10.1 C11.1 C13.2 TP6.TP U1.8(OutC) U1.9(InC-)
NetC10_2: C10.2 C12.2 R4.2 R8.2
NetC11_2: C11.2 C12.1
NetC13_1: C13.1 R12.1 SB1.2 TP7.TP
NetD1_1: D1.1 R15.2
NetQ1_1: Q1.1 R13.2 R14.1
NetR2_1: R2.1 R3.1(CCW) U9.2(-In)
NetR9_1: R9.1 R10.2 U2.2(Vin-)
NetR14_2: R14.2 U5.3
NetSB2#2_1: SB2#2.1 U2.3(Ilim)
NetSB3_1: SB3.1 SB4.1 U2.7(E/S)
NetSB4_2: SB4.2 TP9.TP U5.1
NetSB6_2: SB6.2 U12.6(N_O)
NetTP14_TP: TP14.TP U10.4(Y) U12.3(IN)
NetU1_6: U1.6(InB-) U1.7(OutB)

Not connected (* = marked no-connect by the designer): R3 3(CW); U1 5(InB+); U9 1(OffsetTrim) 5(OffsetTrim) 8(NC); U10 1(NC)

### Notes on the sheet
- Power
- (near SB7) DNP
- DNP SB6 + Populate SB7 to bypass circuit
- (near C1) Smoothes timer signal from RP2040
- (near U1) LPF Output
- AC-Coupled Output
- Populate EITHER SB3 or SB4
- Res between Ilim and V- can be any value to set OPA548 current limit
- TEMP SHUTDOWN SENSE CIRCUIT PROVIDED IN OPA548 DATASHEET
- DWG. NO.
- REV.
- SHT.
- THIS DOCUMENT AND THE DATA DISCLOSED HEREIN OR HEREWITH IS THE PROPERTY OF ALTIUM LIMITED AND MAY BE FREELY DISTRIBUTED IN WHOLE. NO RIGHTS ARE RESERVED OR EXPRESS OR IMPLIED WARANTEE GIVEN.
- REVISION
- DESCRIPTION
- DATE
- APPROVED
- ENG:
- APPROVALS
- PROJECT
- DSN:
- CHK:
- REFERENCE DOCUMENTS
- PROJECT REVISION:
- TITLE
- DOCUMENT REVISION:
- DESIGN ITEM:
- BOM:
- FAB DWG:
- PCB DWG:
- ASSY DWG:
- SCALE:
- SIZE
- B
- CAGE CODE
- FILE NAME
- DWG NO.
- SHEET
- OF
- REV
- (in symbol MMBT2907A-7-F) PMOS
- (in symbol Title_Block) Underwater Robotics Team / Ohio State University; Sheet; of
- (in symbol ZVN3310) NMOS

### Library data of the parts
*#3 = Title_Block: as *#1 on sheet PowerAndConnections
C1-C7 C10-C12 = CMP-2006-03384-2: CAP CER 1000PF 25V 1% NP0 0603; Manufacturer: KEMET; Manufacturer Part Number: C0603C102F3GACTU; Temperature Coefficient: 30ppm/°C; Temperature Characteristic: C0G; Value: 1,000 pF; Tolerance: 0.01; Material: Ceramic; Automotive Grade: Grade 1; Temperature Range Low: -55°C; Device Class L1: Passive Components; Device Class L3: Ceramic Capacitors; Lead Free: Yes; ComponentLink2Description: Datasheet; Mouser Description: Capacitor, Ceramic, 1Nf, 25Vdc, 1-% Tol, 1+% Tol, C0g-Tc Code, -30, 30Ppm-Tc; Device Class L2: Capacitors; RoHS: TRUE; Height: 0.87mm; Digikey Description: CAP CER 1000PF 25V 1% NP0 0603; Temperature Range High: +125°C; ComponentLink2URL: https://api.kemet.com/component-edge/download/datasheet/C0603C100J5GACAUTO.pdf; Capacitance: 1,000 pF; Package: C0603C-CF; Voltage Rating: 25 V; Category: Cap; Automotive: Yes; Temperature: -55°C to +125°C; Octopart: https://octopart.com/c0603c102f3gactu-kemet-9143726
C8 C9 C14 C16 = CAPACITOR_0.1uF_0603_25V: Cap 100nF 25V +/-10% / Ceramic 0603; Voltage: 6.3V; Made By: Flip B; ComponentLink1Description: Datsheet; ComponentLink1URL: https://www.mouser.com/datasheet/2/212/KEM_C1002_X7R_SMD-1102033.pdf; Tolerance: +/- 10%; Supplier 1: Digikey; Supplier Part Number 1: 1276-1006-1-ND
C13 = CAPACITOR_1uF_0603: Cap 1uF 16V +/-10% / Ceramic 0603; Made By: Flip B; Tolerance: +/- 10%; Voltage: 16V; Supplier 1: Arrow Electronics; Supplier Part Number 1: C1608X7R1C105K080AC
C15 = CAPACITOR_0.01uF_0603_50V: 10000 pF ±10% 50V Ceramic Capacitor X7R 0603 (1608 Metric); Tolerance: +/- 10%; Voltage: 6.3V; Made By: Flip B; ComponentLink1Description: Datsheet; ComponentLink1URL: https://www.mouser.com/datasheet/2/212/KEM_C1002_X7R_SMD-1102033.pdf; Supplier 1: Arrow Electronics; Supplier Part Number 1: CL10B103KB8NNNC
C17 C18 = CAP ALUM 10UF 20% 63V SMD: 10 µF 63 V Aluminum - Polymer Capacitors Radial, Can SMD 120mOhm; Made by: Robert Pafford; Tolerance: +/- 20%; Max Voltage: 63V; Supplier 1: Digi-Key; Supplier Part Number 1: P15466CT-ND
D1 = LED_Red_0603: as D11 on sheet PowerAndConnections; Forward Voltage: 2V; Package: 0603; Supplier 1: Digi-Key; Supplier Part Number 1: 732-4978-1-ND
Q1 = MMBT2907A-7-F: as Q2 on sheet PowerAndConnections; Amp Rating: 600mA; BJT Type: PNP; Package: TO-236-3, SC-59, SOT-23-3; Manufacturer_Part_Number: MMBT2907A-7-F; Created By: Robert Pafford; ComponentLink1Description: Datasheet; ComponentLink1URL: https://media.digikey.com/pdf/Data%20Sheets/Diodes%20PDFs/MMBT2907A_Rev2016.pdf; Supplier 1: Digi-Key; Supplier Part Number 1: MMBT2907A-FDICT-ND
R1 = CMP-2000-03179-2: RES Thick Film, 2.55kΩ, 1%, 0.1W, 100ppm/°C, 0603; Resistance: 2.55kR; Power Rating: 100mW; Voltage Rating (DC): 75V; Composition: Thick Film; Min Operating Temperature: -55°C; Case/Package: 0603; Temperature Coefficient: 100ppm/°C; Case Code (Metric): 1608; Radiation Hardening: No; Packaging: Tape and Reel; Length: 1.55mm; Contact Plating: Tin; Case Code (Imperial): 0603; Max Operating Temperature: 155°C; Depth: 0.85mm; Weight: 7.1E-05oz; Termination: SMD/SMT; Width: 0.85mm; Military Standard: Not; Lead Free: Lead Free; Height: 0.45mm; Tolerance: 1%; Voltage Rating: 75V; Package Quantity: 5000
R2 = RESISTOR_4.7K_0603: RES 4.7k OHM 5% 1/10W 0603; Tolerance: +/- 5%; Made By: Robert Pafford; Wattage: 1/10W; Supplier: Digikey; Digikey Part Numer: CR0603-JW-104ELFTR-ND; Supplier 1: Digi-Key; Supplier Part Number 1: RMCF0603JT4K70CT-ND
R3 = TC33X-2-203E: as R22 on sheet Receiving; Value: *; SnapEDA_Link: https://www.snapeda.com/parts/TC33X-2-203E/Bourns/view-part/312812/?ref=snap; Check_prices: https://www.snapeda.com/parts/TC33X-2-203E/Bourns/view-part/312812/?ref=eda; Digi-Key_Part_Number: TC33X-2-203ECT-ND; Purchase-URL: https://pricing.snapeda.com/search/part/TC33X-2-203E/?ref=eda; Package: 1608 Bourns; MP: TC33X-2-203E; Supplier 1: Mouser; Supplier Part Number 1: 652-TC33X-2-203E
R4 = CMP-2100-03665-1: Chip Resistor, 1.5 KOhm, +/- 1%, 0.1 W, -55 to 155 degC, 0603 (1608 Metric), RoHS, Tape and Reel; Manufacturer: Yageo; Power Rating: 100mW; Voltage Rating: 50V; Temperature Coefficient: 100ppm/degreesC; Military Standard: Not; Datasheet URL: http://www.yageo.com/NewPortal/yageodocoutput?fileName=/pdf/R-Chip/PYu-RC_Group_51_RoHS_L_5.pdf; Package Description: 2-Pin Surface Mount Device, Body 1.6 x 0.8 mm; Composition: ThickFilm; Case Code (Metric): 1608; Case/Package: 0603; Number of Terminations: 2; Depth: 0.8mm; Height: 0.022inch; Manufacturer URL: http://www.yageo.com/; Lead Free: LeadFree; Min Operating Temperature: -55degC; Max Operating Temperature: 155degC; Datasheet Version: Rev. 5, 10/2016; RoHSCompliant: true; Max Power Dissipation: 100mW; Packaging: TapeandReel; Voltage Rating (DC): 50V; Length: 0.063inch; Tolerance: 1%; Width: 0.031inch; Number of Pins: 2; Termination: SMD/SMT; Package Reference: 0603; Package Quantity: 1; Case Code (Imperial): 0603; Resistance: 1.5KOhm; REACH SVHC: NoSVHC
R5 = CMP-2000-03305-1: Part Number: CRCW06033K57FKEA; Manufacturer: Vishay Dale
R6 = CMP-2000-03404-1: Part Number: CRCW06034K22FKEA; Manufacturer: Vishay Dale
R7 = RES 3.57K 1% 0603: 3.57 kOhms ±1% 0.1W, 1/10W Chip Resistor 0603 (1608 Metric) Automotive AEC-Q200 Thick Film
R8 = CMP-2000-00290-1: Part Number: ERJ-3EKF1781V; Manufacturer: Panasonic
R9 R11 R13 = RESISTOR_1K_0603: as R17 on sheet PowerAndConnections; ComponentLink1Description: Datasheet; ComponentLink1URL: https://www.bourns.com/docs/product-datasheets/CRxxxxx.pdf; Wattage: 1/8W; Supplier: Digikey; Digikey Part Numer: CR0603-JW-104ELFTR-ND; Supplier 1: Digi-Key; Supplier Part Number 1: 2019-RK73B1JTTD102JCT-ND
R10 = RESISTOR_3.9K_0603: RES 3.9k OHM 1% 1/10W 0603; Tolerance: +/- 1%; Made By: Robert Pafford; Wattage: 1/10W; Supplier 1: Digi-Key; Supplier Part Number 1: P3.90KHCT-ND
R12 = RESISTOR_10K_0603: RES 10k OHM 5% 1/10W 0603; Tolerance: +/- 5%; Wattage: 1/8W; Made By: Robert Pafford; ComponentLink1Description: Datasheet; ComponentLink1URL: https://www.bourns.com/docs/product-datasheets/CRxxxxx.pdf; Supplier: Digikey; Digikey Part Numer: CR0603-JW-104ELFTR-ND; Supplier 1: Digi-Key; Supplier Part Number 1: 2019-RK73B1JTTD103JCT-ND
R14 = RC0603FR-0722KL: RES 22K OHM 1% 1/10W 0603; Tolerance: +/- 1%; Made By: Robert Pafford; Wattage: 1/16W; Supplier 1: Digikey; Supplier Part Number 1: 13-AC0402FR-073K09LCT-ND
R15 = RESISTOR_200_0603: as R19 on sheet PowerAndConnections; ComponentLink1Description: Digikey; ComponentLink1URL: https://www.digikey.com/en/products/detail/koa-speer-electronics-inc/RK73B1JTTD101J/9844701; Wattage: 1/8W; Supplier 1: Digi-Key; Supplier Part Number 1: 2019-RK73B1JTTD221JCT-ND
R16 = RESISTOR_470K_0603: RES 470k OHM 5% 1/10W 0603; Tolerance: +/- 5%; Made By: Robert P; ComponentLink1Description: Datasheet; ComponentLink1URL: https://www.bourns.com/docs/product-datasheets/CRxxxxx.pdf; Wattage: 1/10W; Supplier 1: Digi-Key; Supplier Part Number 1: RMCF0603JT470KCT-ND
SB1 SB2#2 SB3 SB4 SB6 SB7 = JUMPER_0_0603: as SB2#1 on sheet PowerAndConnections; ComponentLink1Description: Digikey; ComponentLink1URL: https://www.digikey.com/en/products/detail/koa-speer-electronics-inc/RK73B1JTTD101J/9844701
TP1-TP10 TP14-TP16 = TESTPOINT: Made By: Robert Pafford
U1 = OPA1664AIDR: IC OPAMP AUDIO 4 CIRCUIT 14SOIC
U2 = OPA548F/500G3: IC POWER 1 CIRCUIT DDPAK/TO263-7
U3 U4 = CDBC560-G: Diode Schottky 60 V 5A Surface Mount DO-214AB (SMC)
U5 = ZVN3310: MOSFET N-CH 100V 100MA SOT23-3
U10 = CMP-08923-000001-1: IC INVERTER SCHMITT 1CH 5SSOP; Manufacturer: Rohm; Standoff Height: 0mm; Number Of Outputs: 1; Logic Function Desc: Inverting; Quiescent Current: 0.2-1uA; Propagation Delay: 50ns; Max Supply Voltage: 16V; Min Supply Voltage: 3V; Max Junction Temp: +150°C; Octopart: https://octopart.com/bu4s584g2-tr-rohm-466637; Temperature Range High: +85°C; Footprint Url: https://d1d2qsbl8m0m72.cloudfront.net/en/techdata_basic/ic/package/ssop5_1-e.pdf; ComponentLink2Description: Datasheet; Temperature Range Low: -40°C; Height: 1.25mm; Device Class L1: Integrated Circuits (ICs); Ipc Land Pattern Name: SOT95P280X125-5; Mouser Description: Inverters IC SCHMITT TRIGGER SINGLE; Digikey Description: IC INVERTER SCHMITT 1CH 5SSOP; Category: IC; Device Class L3: Logic Gates; Lead Free: Yes; Automotive: No; Number Of Circuits: 1; Package: SSOP5; Manufacturer Part Number: BU4S584G2-TR; Number Of Inputs: 1; ComponentLink2URL: https://www.rohm.com/datasheet/BU4S584G2/bu4s584g2-e; Device Class L2: Logic ICs; Temperature: -40°C to +85°C; RoHS: TRUE
U11 U12 = MAX4520EUT+T: Analog Switch SPST Normally Open; MF: Analog Devices; On resistance: 160Ohm; Voltage: 9-36V; Package: SOT-23-6 Analog Devices; Circuit: SPST; Created By: Flip B; ComponentLink1Description: Datasheet; ComponentLink1URL: https://www.analog.com/media/en/technical-documentation/data-sheets/max4510-max4520.pdf; Supplier 1: Digi-Key; Supplier Part Number 1: MAX4520EUT+TCT-ND

## Nets that join several sheets
5V: PowerAndConnections (8 pins), Transmission (Q1.3 R13.1)
+5: PowerAndConnections (5 pins), Receiving (8 pins), Transmission (U1.4 U10.5 U11.1 U12.1)
+24: PowerAndConnections (C43.2 D4.1 TP11.TP U6.3), Transmission (8 pins)
-5: PowerAndConnections (5 pins), Receiving (8 pins), Transmission (U1.11 U11.2 U12.2)
-24: PowerAndConnections (5 pins), Transmission (9 pins)
GND: PowerAndConnections (36 pins), Receiving (21 pins), Transmission (18 pins)
HydrophoneIn: PowerAndConnections (J1.3 SB2#1.1), Receiving (R24.2 SB8.2 TP17.TP)
TransducerOut: PowerAndConnections (J1.1), Transmission (5 pins)